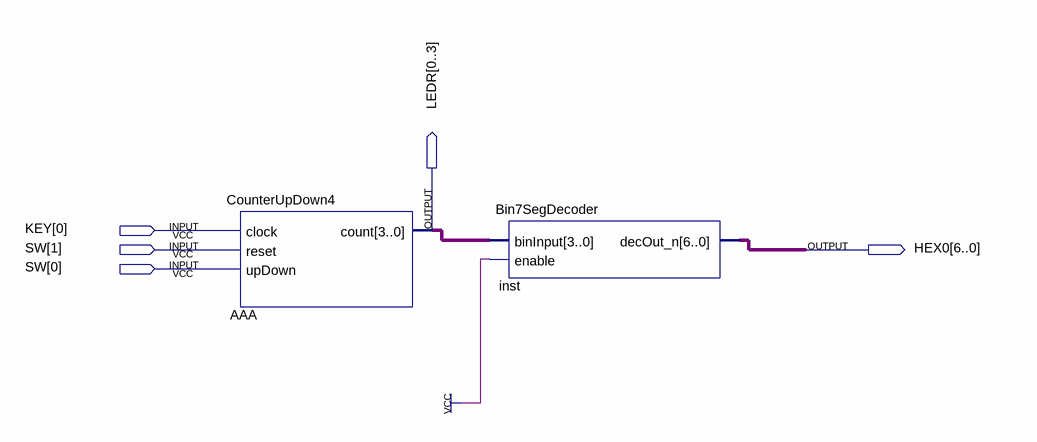
[diagram p0: schematic sheet]
// Quartus schematic Counter_Demo.bdf as structural Verilog: 2 symbols, 5 pins
module Counter_Demo (
  input  [0:0] KEY,
  input  [1:0] SW,
  output [0:3] LEDR,
  output [6:0] HEX0
);

  CounterUpDown4 AAA (.clock(KEY[0]), .reset(SW[1]), .upDown(SW[0]), .count(LEDR));
  Bin7SegDecoder inst (.binInput(LEDR), .enable(1'b1), .decOut_n(HEX0));
endmodule
